# EAGLE design emojipad_v1 (EAGLE 6.4)
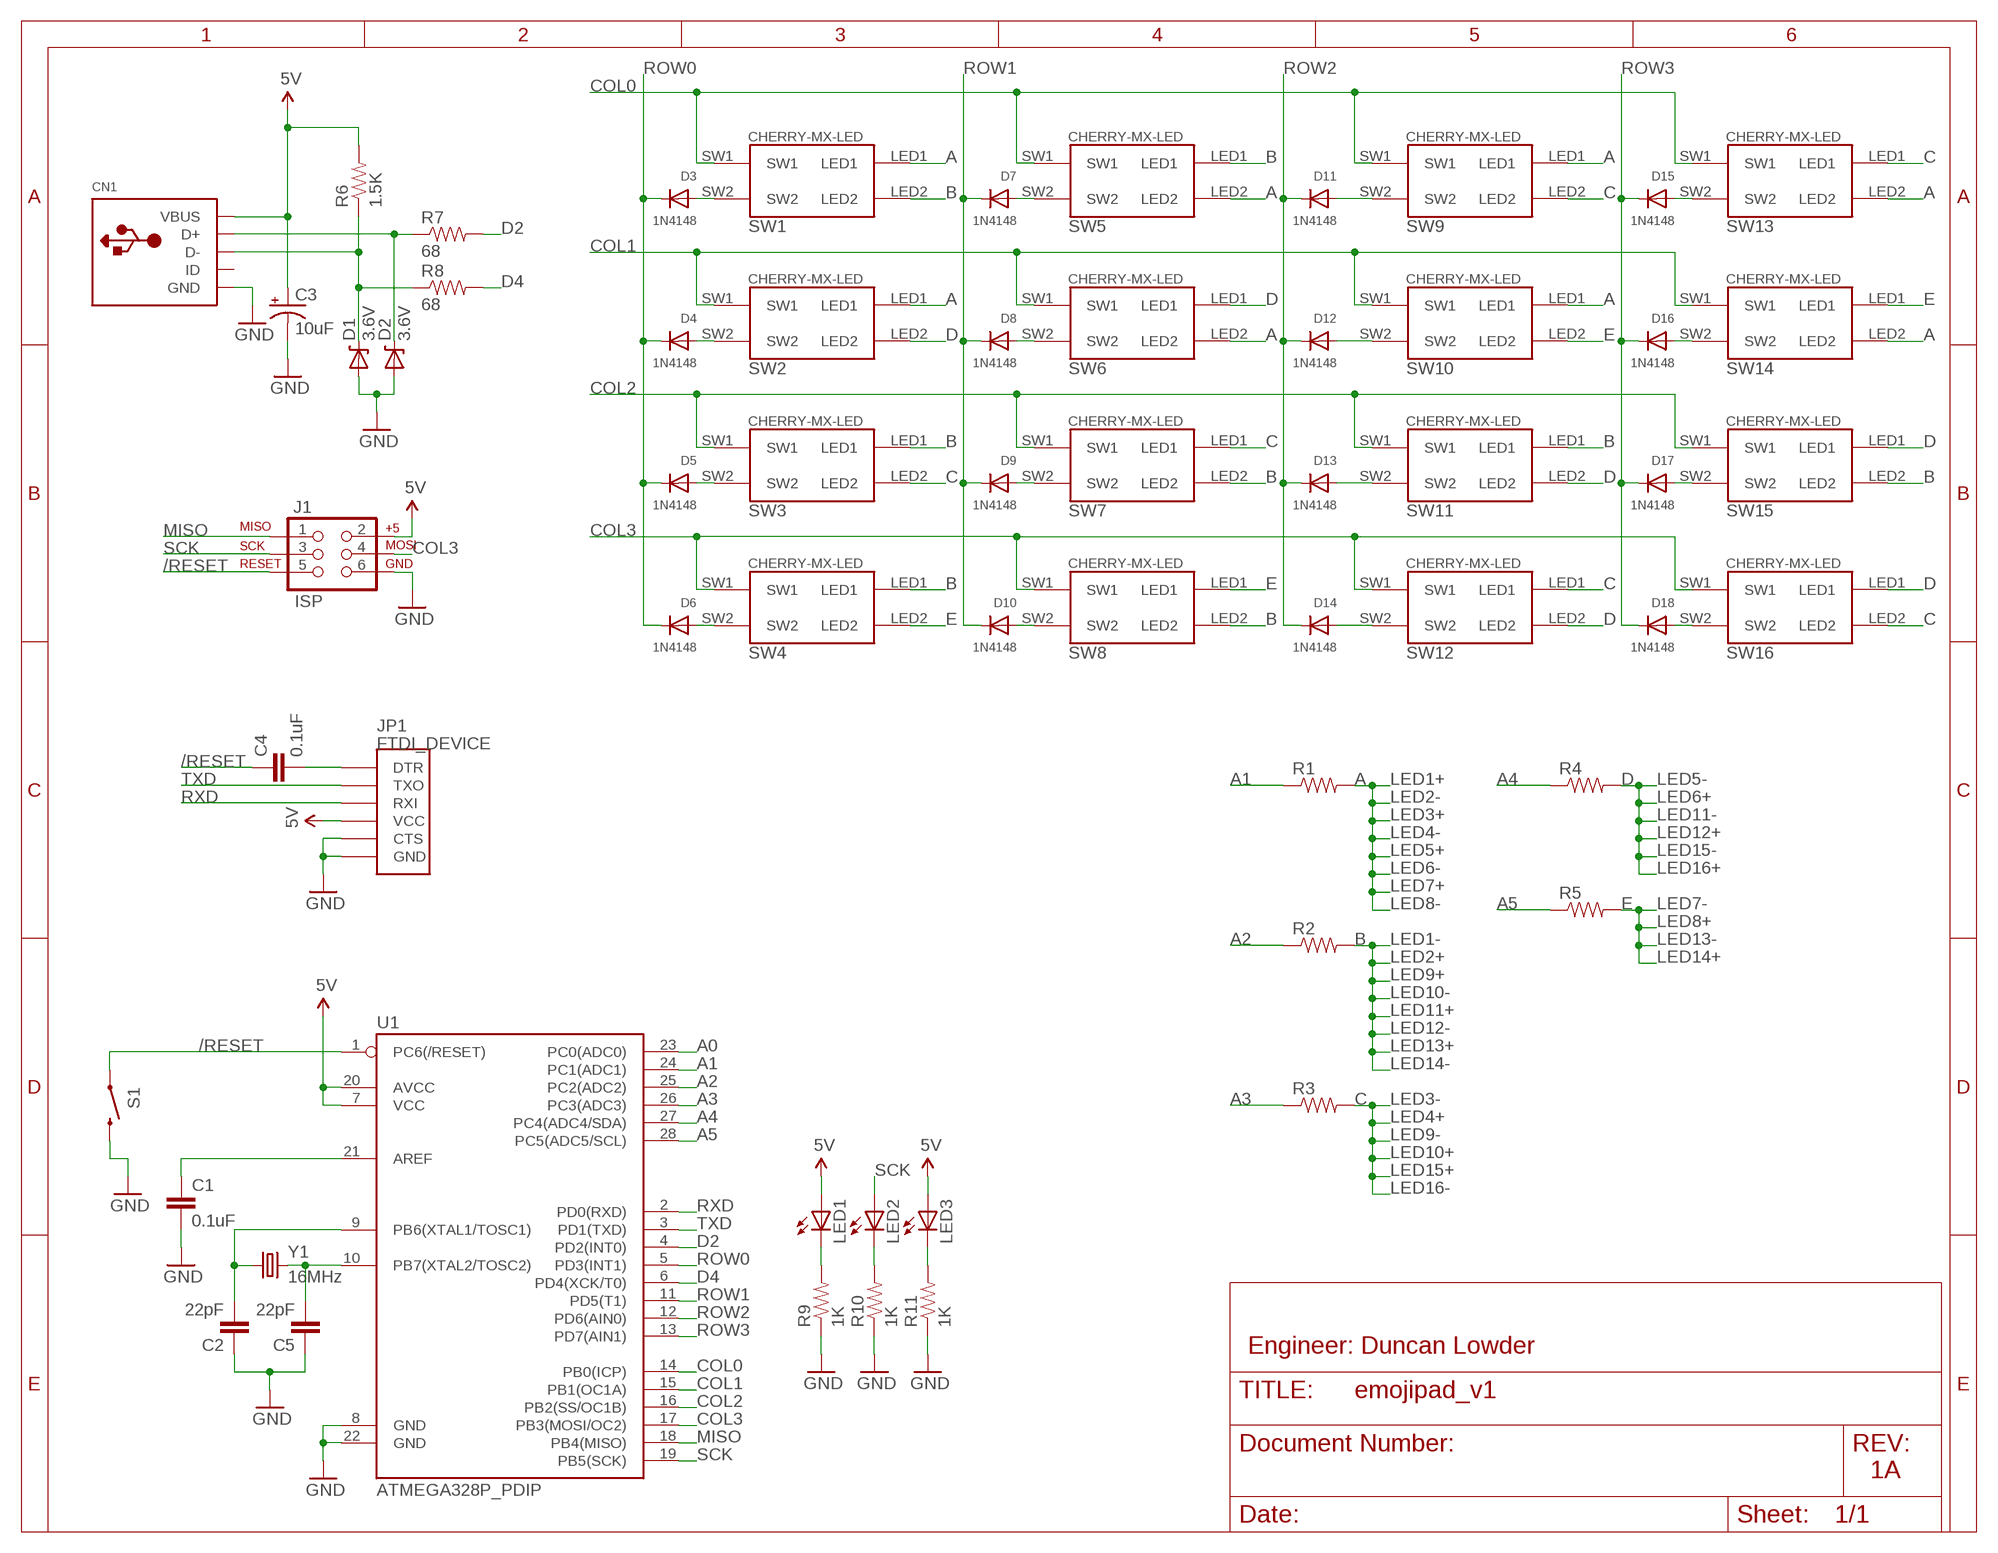
[diagram p0: schematic, sheet 1]

## Parts
C1  0.1uF  CAPPTH  [CAP-PTH-SMALL]
C2  22pF  CAPPTH  [CAP-PTH-SMALL]
C3  10uF  CAP_POLPTH2  [CPOL-RADIAL-10UF-25V]
C4  0.1uF  CAPPTH  [CAP-PTH-SMALL]
C5  22pF  CAPPTH  [CAP-PTH-SMALL]
CN1  USBMOLEX  [USB-MINIB-THM-MOLEX]
D1  3.6V  DIODE-ZENERPTH  [DIODE-ZENER]
D2  3.6V  DIODE-ZENERPTH  [DIODE-ZENER]
D3  1N4148  DIODEDO-1N4148  [DO-1N4148]
D4  1N4148  DIODEDO-1N4148  [DO-1N4148]
D5  1N4148  DIODEDO-1N4148  [DO-1N4148]
D6  1N4148  DIODEDO-1N4148  [DO-1N4148]
D7  1N4148  DIODEDO-1N4148  [DO-1N4148]
D8  1N4148  DIODEDO-1N4148  [DO-1N4148]
D9  1N4148  DIODEDO-1N4148  [DO-1N4148]
D10  1N4148  DIODEDO-1N4148  [DO-1N4148]
D11  1N4148  DIODEDO-1N4148  [DO-1N4148]
D12  1N4148  DIODEDO-1N4148  [DO-1N4148]
D13  1N4148  DIODEDO-1N4148  [DO-1N4148]
D14  1N4148  DIODEDO-1N4148  [DO-1N4148]
D15  1N4148  DIODEDO-1N4148  [DO-1N4148]
D16  1N4148  DIODEDO-1N4148  [DO-1N4148]
D17  1N4148  DIODEDO-1N4148  [DO-1N4148]
D18  1N4148  DIODEDO-1N4148  [DO-1N4148]
J1  ISP  AVR_SPI_PRG_6PTH  [2X3]
JP1  FTDI_DEVICE  [FTDI_DEVICE_SIDE]
LED1  LED3MM  [LED3MM]
LED2  LED3MM  [LED3MM]
LED3  LED3MM  [LED3MM]
R1  RESISTORAXIAL-0.3  [AXIAL-0.3]
R2  RESISTORAXIAL-0.3  [AXIAL-0.3]
R3  RESISTORAXIAL-0.3  [AXIAL-0.3]
R4  RESISTORAXIAL-0.3  [AXIAL-0.3]
R5  RESISTORAXIAL-0.3  [AXIAL-0.3]
R6  1.5K  RESISTORAXIAL-0.3  [AXIAL-0.3]
R7  68  RESISTORAXIAL-0.3  [AXIAL-0.3]
R8  68  RESISTORAXIAL-0.3  [AXIAL-0.3]
R9  1K  RESISTORAXIAL-0.3  [AXIAL-0.3]
R10  1K  RESISTORAXIAL-0.3  [AXIAL-0.3]
R11  1K  RESISTORAXIAL-0.3  [AXIAL-0.3]
S1  SWITCH-MOMENTARY-2SIDE_EZ  [TACTILE-PTH-SIDEEZ]
SW1  CHERRY-MX-LED  [CHERRY-MX-LED]
SW2  CHERRY-MX-LED  [CHERRY-MX-LED]
SW3  CHERRY-MX-LED  [CHERRY-MX-LED]
SW4  CHERRY-MX-LED  [CHERRY-MX-LED]
SW5  CHERRY-MX-LED  [CHERRY-MX-LED]
SW6  CHERRY-MX-LED  [CHERRY-MX-LED]
SW7  CHERRY-MX-LED  [CHERRY-MX-LED]
SW8  CHERRY-MX-LED  [CHERRY-MX-LED]
SW9  CHERRY-MX-LED  [CHERRY-MX-LED]
SW10  CHERRY-MX-LED  [CHERRY-MX-LED]
SW11  CHERRY-MX-LED  [CHERRY-MX-LED]
SW12  CHERRY-MX-LED  [CHERRY-MX-LED]
SW13  CHERRY-MX-LED  [CHERRY-MX-LED]
SW14  CHERRY-MX-LED  [CHERRY-MX-LED]
SW15  CHERRY-MX-LED  [CHERRY-MX-LED]
SW16  CHERRY-MX-LED  [CHERRY-MX-LED]
U1  ATMEGA328P_PDIP  [DIL28-3]
Y1  16MHz  CRYSTALHC49US  [HC49US]

## Nets
5V: C3.1(+) CN1.VBUS J1.2 JP1.P$4(VCC) LED1.A LED3.A R6.P$2 U1.7(VCC) U1.20(AVCC)
/RESET: C4.1 J1.5 S1.1 U1.1(PC6(/RESET))
A: R1.P$2 SW1.LED1 SW2.LED1 SW5.LED2 SW6.LED2 SW9.LED1 SW10.LED1 SW13.LED2 SW14.LED2
A0: U1.23(PC0(ADC0))
A1: R1.P$1 U1.24(PC1(ADC1))
A2: R2.P$1 U1.25(PC2(ADC2))
A3: R3.P$1 U1.26(PC3(ADC3))
A4: R4.P$1 U1.27(PC4(ADC4/SDA))
A5: R5.P$1 U1.28(PC5(ADC5/SCL))
B: R2.P$2 SW1.LED2 SW3.LED1 SW4.LED1 SW5.LED1 SW7.LED2 SW8.LED2 SW11.LED1 SW15.LED2
C: R3.P$2 SW3.LED2 SW7.LED1 SW9.LED2 SW12.LED1 SW13.LED1 SW16.LED2
COL0: SW1.SW1 SW5.SW1 SW9.SW1 SW13.SW1 U1.14(PB0(ICP))
COL1: SW2.SW1 SW6.SW1 SW10.SW1 SW14.SW1 U1.15(PB1(OC1A))
COL2: SW3.SW1 SW7.SW1 SW11.SW1 SW15.SW1 U1.16(PB2(SS/OC1B))
COL3: J1.4 SW4.SW1 SW8.SW1 SW12.SW1 SW16.SW1 U1.17(PB3(MOSI/OC2))
D: R4.P$2 SW2.LED2 SW6.LED1 SW11.LED2 SW12.LED2 SW15.LED1 SW16.LED1
D2: R7.P$2 U1.4(PD2(INT0))
D4: R8.P$2 U1.6(PD4(XCK/T0))
D+: CN1.D+ D2.P$1(C) R7.P$1
D-: CN1.D- D1.P$1(C) R6.P$1 R8.P$1
E: R5.P$2 SW4.LED2 SW8.LED1 SW10.LED2 SW14.LED1
GND: C1.2 C2.1 C3.2(-) C5.1 CN1.GND D1.P$2(A) D2.P$2(A) J1.6 JP1.P$5(CTS) JP1.P$6(GND) R9.P$1 R10.P$1 R11.P$1 S1.2 U1.8(GND) U1.22(GND)
MISO: J1.1 U1.18(PB4(MISO))
N$1: LED1.K(C) R9.P$2
N$2: D3.A SW1.SW2
N$3: D4.A SW2.SW2
N$4: D5.A SW3.SW2
N$5: C1.1 U1.21(AREF)
N$6: C5.2 U1.10(PB7(XTAL2/TOSC2)) Y1.2
N$7: D6.A SW4.SW2
N$8: D7.A SW5.SW2
N$9: D8.A SW6.SW2
N$10: D9.A SW7.SW2
N$11: D10.A SW8.SW2
N$12: D11.A SW9.SW2
N$13: D12.A SW10.SW2
N$14: D13.A SW11.SW2
N$15: D14.A SW12.SW2
N$16: D15.A SW13.SW2
N$17: D16.A SW14.SW2
N$18: D17.A SW15.SW2
N$19: D18.A SW16.SW2
N$20: C2.2 U1.9(PB6(XTAL1/TOSC1)) Y1.1
N$21: LED2.K(C) R10.P$2
N$23: LED3.K(C) R11.P$2
N$26: C4.2 JP1.P$1(DTR)
ROW0: D3.C D4.C D5.C D6.C U1.5(PD3(INT1))
ROW1: D7.C D8.C D9.C D10.C U1.11(PD5(T1))
ROW2: D11.C D12.C D13.C D14.C U1.12(PD6(AIN0))
ROW3: D15.C D16.C D17.C D18.C U1.13(PD7(AIN1))
RXD: JP1.P$3(RXI) U1.2(PD0(RXD))
SCK: J1.3 LED2.A U1.19(PB5(SCK))
TXD: JP1.P$2(TXO) U1.3(PD1(TXD))
Unconnected: CN1.ID

## Notes on the sheet
- LED1+ | LED5-
- LED2- | LED6+
- LED3+ | LED11-
- LED4- | LED12+
- LED5+ | LED15-
- LED6- | LED16+
- LED7+
- LED8- | LED7-
- LED8+
- LED1- | LED13-
- LED2+ | LED14+
- LED9+
- LED10-
- LED11+
- LED12-
- LED13+
- LED14-
- LED3-
- LED4+
- LED9-
- LED10+
- LED15+
- LED16-
- Engineer: Duncan Lowder
- 1A

## Library data of the parts
C1 C2 C5 = SparkFun-Capacitors:CAP: Capacitor Standard 0603 ceramic capacitor, and 0.1" leaded capacitor.
C3 = SparkFun-Capacitors:CAP_POL: Capacitor Polarized These are standard SMD and PTH capacitors. Normally 10uF, 47uF, and 100uF in electrolytic and tantalum varieties. Always verify the external diameter of the through hole cap, it varies with capacity, voltage, and manufacturer. The EIA devices should be standard.
C4 = SparkFun-Passives:CAP: Capacitor Standard 0603 ceramic capacitor, and 0.1" leaded capacitor.
CN1 = adafruit_1:USB: USB Connectors USBMINIB - Surface Mount Female Mini-B USB Connector 4UConnector: 06564 By microbuilder.eu Thru-hole RA Female Mini-B USB Connector 4UConnector: 18732 By ladyada.net
D1 D2 = SparkFun-DiscreteSemi:DIODE-ZENER: Zener Diode Production Part - 8199 3.4V Zener Voltage
D3-D18 = adafruit:DIODE: Diode SMADIODE - SMA Surface Mount Package 20V 1A Schottky Diode Digikey: 641-1014-6-ND DO-1N4148 - Through Hole Small Current Diode SOD-123 20V 1 A (.5mV Vf) Schottky Diode - Digikey: MBRX120TPMSCT-ND SOD-323 10V 570mA (.38mV Vf, 3ns) Schottky Diode - Digikey: ZLLS410CT-ND SOD-523 30V 30mA Schottky Diode (RB751S-40TE61) - Digikey: RB751S-40TE61CT-ND SOT23-R/W - SOT23 Package (R = Solder Paste/Reflow Ovens, W = Hand-Soldering) BAT54Film 40V 300mA - Digikey: 497-7162-1-ND
J1 = SparkFun-Connectors:AVR_SPI_PRG_6: AVR ISP 6 Pin This is the reduced ISP connector for AVR programming. Common on Arduino. This footprint will take up less PCB space and can be used with a 10-pin to 6-pin adapter such as SKU: BOB-08508
JP1 = SparkFun-Connectors:FTDI_DEVICE: Connector which mates to FTDI basic or FTDI cable.
LED1-LED3 = SparkFun-LED:LED: LEDs Standard schematic elements and footprints for 5mm, 3mm, 1206, and 0603 sized LEDs. 5mm - Spark Fun Electronics SKU : COM-00529 (and others)
R1-R6 R9-R11 = SparkFun-Passives:RESISTOR: Resistor Basic schematic elements and footprints for 0603, 1206, and PTH resistors.
R7 R8 = SparkFun-Resistors:RESISTOR: Resistor Basic schematic elements and footprints for 0603, 1206, and PTH resistors.
S1 = SparkFun-Electromechanical:SWITCH-MOMENTARY-2: Various NO switches- pushbuttons, reed, etc
SW1-SW16 = cherrymx:CHERRY-MX-LED: Cherry MX series keyswitch with LED
U1 = SparkFun-DigitalIC:ATMEGA328P_PDIP: uC used in the Arduino 32kb flash, 1k EEPROM, 2k SRAM This is the through-hole version of this chip.
Y1 = SparkFun-FreqCtrl:CRYSTAL: Various standard crystals. Proven footprints. Spark Fun Electronics SKU : COM-00534

## Board
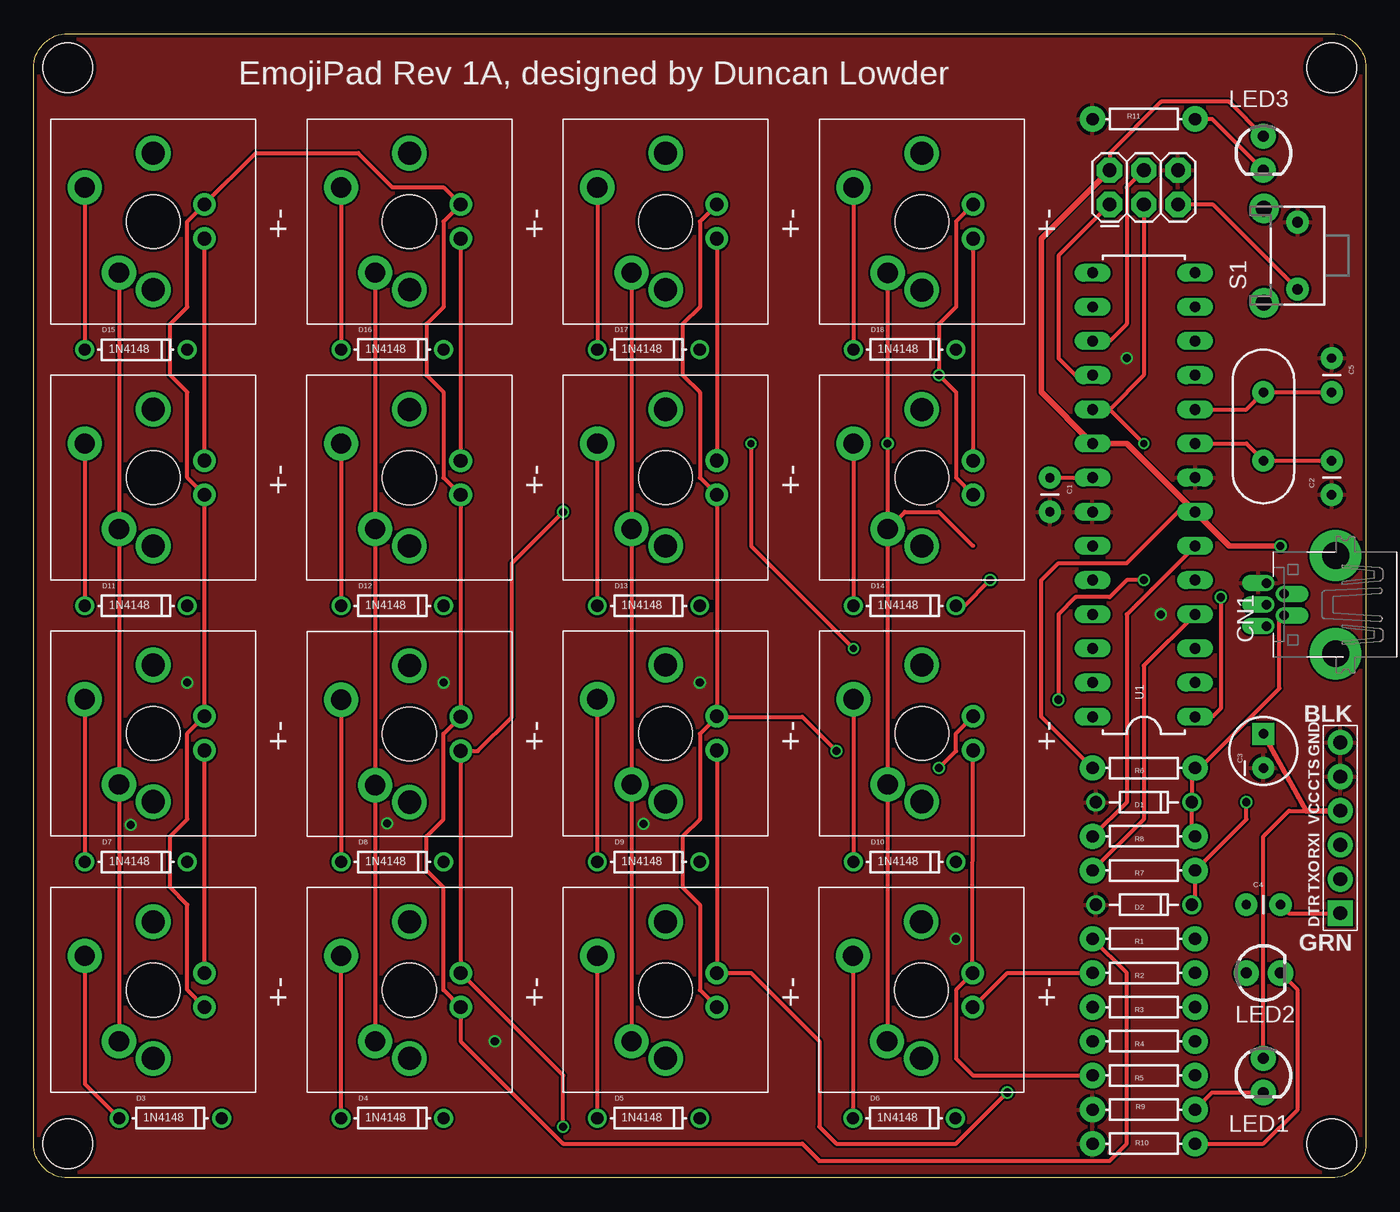
[diagram p1: board, top side]
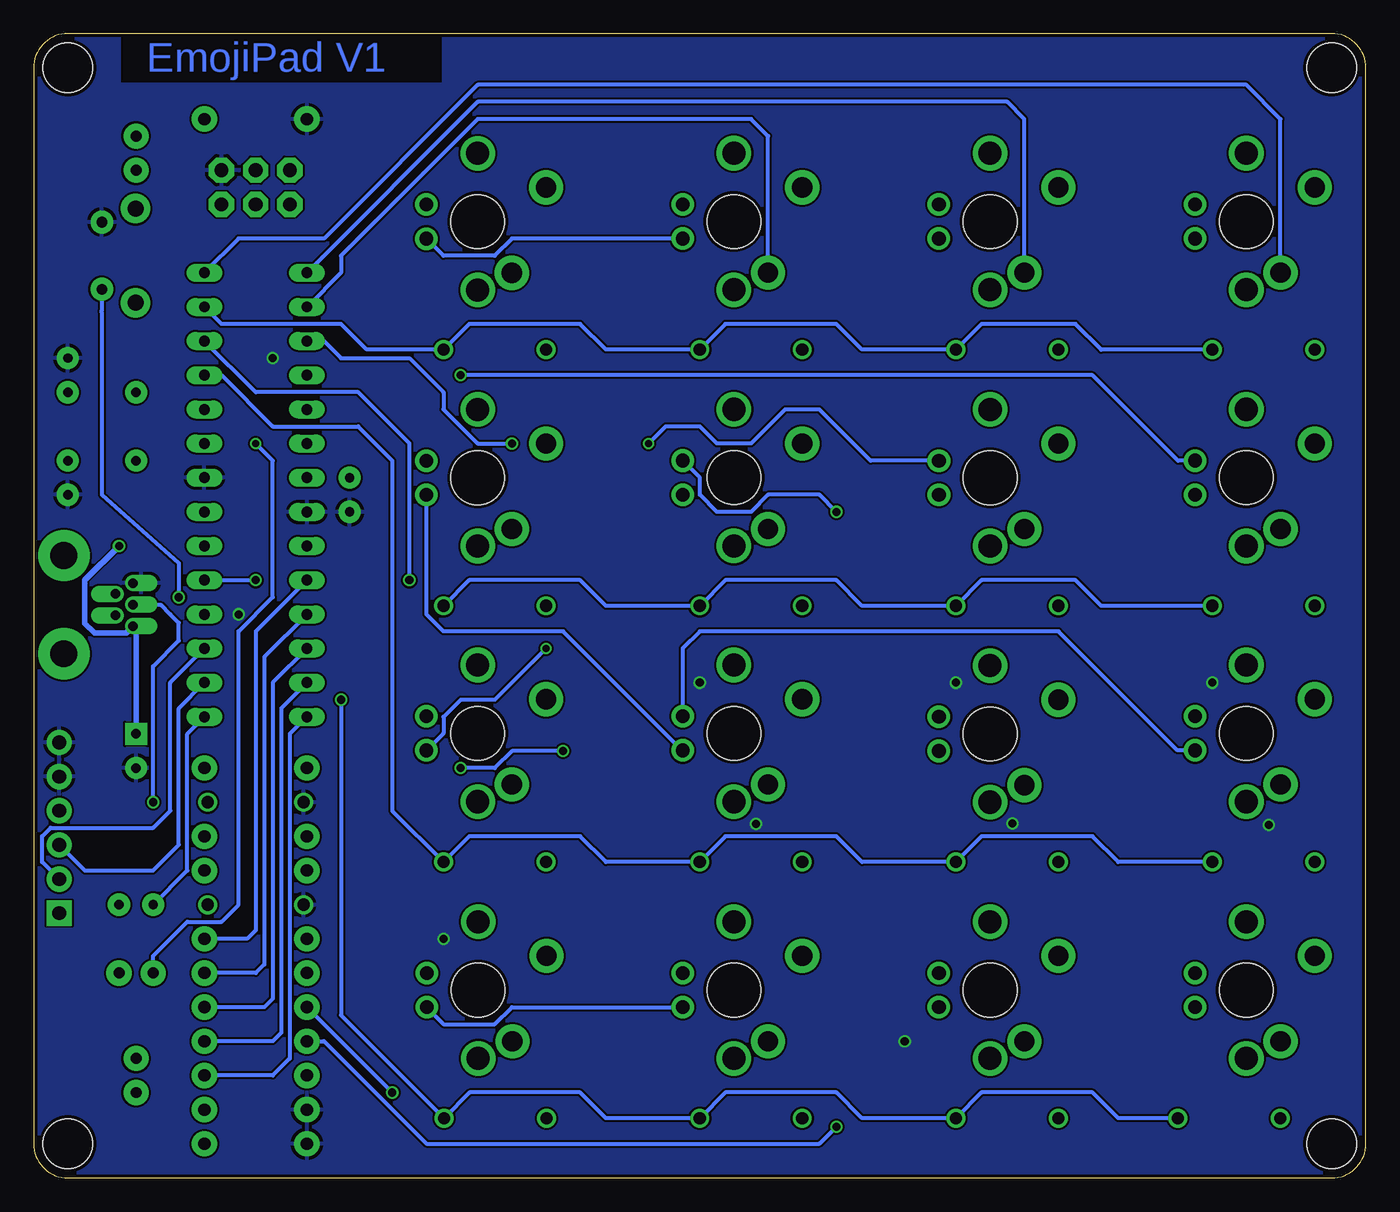
[diagram p2: board, bottom side, seen from below]

Size 99.06 x 85.09 mm. Coordinates in mm from the lower left corner, seen from the top.
Outline: 2.54,85.09 96.52,85.09 arc-90 99.06,82.55 99.06,2.54 arc-90 96.52,0 2.54,0 arc-90 0,2.54 0,82.55 arc-90 2.54,85.09
Copper layers (1*16): Top 0.035mm / dielectric 1.5mm / Bottom 0.035mm
Design rules "SeeedStudio_2layer_DRU_no_angle_20140221": minimum track width 6mil, minimum drill 12mil, track to track 6mil, track to pad 6mil, pad to pad 6mil, via to via 6mil, smd to smd 0mil, copper to edge 10mil, drill to drill 10mil, minimum pad ring 10mil, minimum via ring 6mil, stop-mask expansion 2mil, vias tented up to drill 100mil, thermal gap 10mil
Holes 3.7 mm at 96.52,2.54 2.54,2.54 2.54,82.55 96.52,82.55

### Footprints (pad centres in the part's own frame; a part is rotated, then mirrored left to right if it is on the bottom)
CAP-PTH-SMALL = drill 0.7 pad 1.651: 1 0,0; 2 2.54,0
CPOL-RADIAL-10UF-25V = drill 0.7 pad 1.651 square: 1 1.27,0 | drill 0.7 pad 1.651: 2 -1.27,0
USB-MINIB-THM-MOLEX = drill 0.7 offset: D+ 0,9.72; D- -0.8,8.42; GND 1.6,9.72; ID 0.8,8.42; VBUS -1.6,9.72 | drill 2 pad 3.81: GND1 -3.65,4.57; GND4 3.65,4.57
DIODE-ZENER = drill 0.9: P$1 -3.556,0; P$2 3.556,0
DO-1N4148 = drill 0.9: A -3.81,0; C 3.81,0
2X3 = drill 1.016 pad 1.88 octagon: 1 0,0; 2 0,2.54; 3 2.54,0; 4 2.54,2.54; 5 5.08,0; 6 5.08,2.54
FTDI_DEVICE_SIDE = drill 1.016 pad 1.88 square: P$1 -6.35,0 | drill 1.016 pad 1.88: P$2 -3.81,0; P$3 -1.27,0; P$4 1.27,0; P$5 3.81,0; P$6 6.35,0
LED3MM = drill 0.813 pad 1.88: A -1.27,0; K 1.27,0
AXIAL-0.3 = drill 0.9 pad 1.88: P$1 -3.81,0; P$2 3.81,0
TACTILE-PTH-SIDEEZ = drill 0.8 pad 1.7: 1 -2.5,0; 2 2.5,0 | drill 1.2 pad 2.2: ANCHOR1 -3.5,2.5; ANCHOR2 3.5,2.5
CHERRY-MX-LED = drill 1.016 pad 1.676: LED1 -1.27,-3.81; LED2 1.27,-3.81 | drill 1.714 pad 1.93: P$3 -5.08,0; P$4 5.08,0 | drill 1.5 pad 2.54: SW1 -3.81,2.54; SW2 2.54,5.08 | hole 4: 0,0
DIL28-3 = drill 0.813 long: 1 -16.51,-3.81; 2 -13.97,-3.81; 3 -11.43,-3.81; 4 -8.89,-3.81; 5 -6.35,-3.81; 6 -3.81,-3.81; 7 -1.27,-3.81; 8 1.27,-3.81; 9 3.81,-3.81; 10 6.35,-3.81; 11 8.89,-3.81; 12 11.43,-3.81; 13 13.97,-3.81; 14 16.51,-3.81; 15 16.51,3.81; 16 13.97,3.81; 17 11.43,3.81; 18 8.89,3.81; 19 6.35,3.81; 20 3.81,3.81; 21 1.27,3.81; 22 -1.27,3.81; 23 -3.81,3.81; 24 -6.35,3.81; 25 -8.89,3.81; 26 -11.43,3.81; 27 -13.97,3.81; 28 -16.51,3.81
HC49US = drill 0.7 pad 1.651: 1 -2.54,0; 2 2.54,0

### Placement (x,y rotation side)
C1  75.56,52.07 270 top
C2  96.52,50.8 90 top
C3  91.44,31.75 90 top
C4  90.17,20.32 0 top
C5  96.52,60.96 270 top
CN1  101.38,42.63 90 top
D1  82.55,27.94 180 top
D2  82.55,20.32 180 top
D3  10.16,4.45 0 top
D4  26.67,4.45 0 top
D5  45.72,4.45 0 top
D6  64.73,4.45 0 top
D7  7.62,23.5 0 top
D8  26.67,23.5 0 top
D9  45.72,23.5 0 top
D10  64.77,23.5 0 top
D11  7.62,42.55 0 top
D12  26.67,42.55 0 top
D13  45.72,42.55 0 top
D14  64.77,42.55 0 top
D15  7.6,61.59 0 top
D16  26.67,61.59 0 top
D17  45.72,61.59 0 top
D18  64.77,61.59 0 top
J1  80.01,72.39 0 top
JP1  97.16,26.04 90 top
LED1  91.44,7.62 270 top
LED2  91.44,15.24 0 top
LED3  91.44,76.2 270 top
R1  82.55,17.78 180 top
R2  82.55,15.24 180 top
R3  82.55,12.7 180 top
R4  82.55,10.16 180 top
R5  82.55,7.62 180 top
R6  82.55,30.48 180 top
R7  82.55,22.86 180 top
R8  82.55,25.4 180 top
R9  82.55,5.08 0 top
R10  82.55,2.54 0 top
R11  82.55,78.74 0 top
S1  93.98,68.58 90 top
SW1  8.89,13.97 90 top
SW2  27.94,13.97 90 top
SW3  46.99,13.97 90 top
SW4  66,13.97 90 top
SW5  8.89,33.06 90 top
SW6  27.94,33.02 90 top
SW7  46.99,33.06 90 top
SW8  66.04,33.06 90 top
SW9  8.89,52.07 90 top
SW10  27.94,52.07 90 top
SW11  46.99,52.07 90 top
SW12  66.04,52.07 90 top
SW13  8.89,71.12 90 top
SW14  27.94,71.12 90 top
SW15  46.99,71.12 90 top
SW16  66.04,71.11 90 top
U1  82.55,50.8 90 top
Y1  91.44,55.88 90 top

### Tracks (layer width: path | path; a pad name or v marks a point on that pad's centre or on a via)
5V  (via drill 0.6)
  Top 0.305: R6.P$2 74.93,34.29 74.93,44.45 76.2,45.72 81.28,45.72 85.09,49.53 U1.7 | 96.52,27.3 93.34,27.3 91.44,25.4 LED1.A | LED3.A 88.9,80.01 83.82,80.01 80.01,76.2 J1.2
  Top 0.406: J1.2 74.93,69.85 74.93,58.42 U1.20 81.28,54.61 U1.7 88.9,46.99 v92.71,46.99 | C3.1 94.61,27.3 96.52,27.3 JP1.P$4
  Bottom 0.406: v92.71,46.99 95.25,44.45 95.25,41.23 94.53,40.51 92.18,40.51 CN1.VBUS 91.44,40.8 C3.1
/RESET  (via drill 0.6)
  Top 0.305: v88.27,43.18 88.27,34.92 87.63,34.29 U1.1 | J1.5 87.67,72.39 S1.1
  Bottom 0.305: C4.1 87.63,22.86 87.63,33.02 U1.1 | v88.27,43.18 88.27,45.72 93.98,50.8 93.98,64.34 93.99,64.53 93.98,64.77 S1.1
A
  Top 0.305: SW9.LED1 SW5.LED2 11.43,33.06 11.43,26.67 10.16,25.4 10.16,21.59 11.43,20.32 11.43,13.97 SW1.LED1 | SW13.LED2 | SW13.LED2 16.51,76.2 24.13,76.2 26.67,73.66 30.48,73.66 SW14.LED2 30.48,71.12 30.48,64.77 29.21,63.5 29.21,59.69 30.48,58.42 30.48,52.06 SW10.LED1 SW6.LED2 30.48,33.02 30.48,26.67 29.21,25.4 29.21,22.86 30.48,21.59 30.48,13.97 SW2.LED1 31.75,10.16 39.37,2.54 57.15,2.54 58.42,1.27 80.01,1.27 81.28,2.54 81.28,15.24 R1.P$2 | SW9.LED1 | SW9.LED1 11.43,52.07 11.43,58.42 10.16,59.69 10.16,63.5 11.43,64.77 11.43,71.12 SW13.LED2
A1
  Bottom 0.305: U1.24 82.55,40.64 82.55,18.41 83.19,17.78 R1.P$1
A2
  Bottom 0.305: U1.25 81.92,38.73 81.92,15.88 82.55,15.24 R2.P$1
A3
  Bottom 0.305: U1.26 81.28,36.83 81.28,13.34 81.92,12.7 R3.P$1
A4
  Bottom 0.305: U1.27 80.64,34.92 80.64,10.79 81.28,10.16 R4.P$1
A5
  Bottom 0.305: U1.28 80.01,33.02 80.01,8.89 81.28,7.62 R5.P$1
B  (via drill 0.6)
  Top 0.305: SW5.LED1 SW1.LED2 | SW15.LED2 49.53,71.12 49.53,64.77 48.26,63.5 48.26,59.69 49.53,58.42 49.53,52.07 SW11.LED1 SW7.LED2 50.8,34.29 | 50.8,34.29 49.53,33.02 49.53,26.67 48.26,25.4 48.26,21.59 49.53,20.32 49.53,13.97 SW3.LED1 | 50.8,34.29 57.15,34.29 v59.69,31.75 | v67.31,30.48 68.58,31.75 68.58,33.06 SW8.LED2 | SW4.LED1 69.85,12.7 72.39,15.24 R2.P$2
  Bottom 0.305: SW5.LED1 14.01,31.79 22.86,40.64 49.53,40.64 50.8,39.37 SW7.LED2 | v59.69,31.75 63.5,31.75 64.77,30.48 v67.31,30.48 | SW4.LED1 69.81,12.66 68.58,11.43 64.77,11.43 63.5,12.7 SW3.LED1
C  (via drill 0.6)
  Top 0.305: SW13.LED1 SW9.LED2 | SW7.LED1 SW3.LED2 53.34,15.24 58.42,10.16 58.42,3.81 59.69,2.54 68.58,2.54 v72.39,6.35 | SW16.LED2 68.58,71.12 68.58,64.77 67.31,63.5 v67.31,59.69 68.58,58.42 68.58,52.07 SW12.LED1
  Bottom 0.305: SW9.LED2 13.97,53.34 20.32,59.69 v67.31,59.69 | SW7.LED1 50.84,31.79 59.69,40.64 68.58,40.64 69.85,41.91 SW12.LED1 | v72.39,6.35 R3.P$2
COL0
  Top 0.305: SW13.SW1 SW9.SW1 SW5.SW1 SW1.SW1
  Bottom 0.305: SW13.SW1 6.35,78.74 8.89,81.28 66.04,81.28 77.47,69.85 83.82,69.85 U1.14
COL1
  Top 0.305: SW10.SW1 SW6.SW1 SW2.SW1 | SW14.SW1 SW10.SW1 | SW10.SW1
  Bottom 0.305: SW14.SW1 25.4,78.74 26.67,80.01 66.04,80.01 U1.15
COL2
  Top 0.305: SW15.SW1 SW11.SW1 SW7.SW1 44.45,29.21 SW3.SW1
  Bottom 0.305: SW15.SW1 44.45,77.47 45.72,78.74 66.04,78.74 76.2,68.58 76.2,67.31 U1.16
COL3  (via drill 0.6)
  Top 0.305: J1.4 81.28,73.66 81.28,63.5 80.01,62.23 U1.17 | SW16.SW1 v63.5,54.61 SW12.SW1 | SW12.SW1 SW8.SW1 63.5,10.16 SW4.SW1 | SW12.SW1 64.77,49.53 67.31,49.53 69.85,46.99
  Bottom 0.305: U1.17 77.47,62.23 76.2,60.96 71.12,60.96 68.58,58.42 68.58,57.15 66.04,54.61 v63.5,54.61
D  (via drill 0.6)
  Top 0.305: SW15.LED1 SW11.LED2 | SW16.LED1 SW12.LED2 | v39.37,49.53 35.56,45.72 35.56,34.29 33.02,31.75 SW6.LED1 SW2.LED2 39.37,7.62 v39.37,3.81
  Bottom 0.305: SW15.LED1 63.5,69.85 64.77,68.58 68.59,68.58 SW16.LED1 | v39.37,49.53 40.64,50.8 44.45,50.8 45.72,49.53 48.26,49.53 49.53,50.8 49.53,52.07 SW11.LED2 | R4.P$2 77.47,10.16 69.85,2.54 40.64,2.54 v39.37,3.81
D2
  Top 0.305: U1.4 82.55,38.1 82.55,26.67 R7.P$2
D4
  Top 0.305: U1.6 81.28,41.91 81.28,27.94 R8.P$2
D+  (via drill 0.6)
  Top 0.305: D2.P$1 86.36,20.57 R7.P$1 90.17,26.67 v90.17,27.94
  Bottom 0.305: v90.17,27.94 90.17,38.05 88.27,39.95 88.27,41.27 88.9,41.91 88.91,41.91 89.59,42.59 91.63,42.59 CN1.D+
D-
  Top 0.305: R8.P$1 86.11,25.65 D1.P$1 86.11,30.23 R6.P$1 86.72,30.48 92.63,36.4 92.63,41.5 CN1.D-
E  (via drill 0.5)
  Top 0.305: SW8.LED1 SW4.LED2 69.81,15.2 68.58,13.97 68.58,8.89 69.85,7.62 R5.P$2 | SW14.LED1 SW10.LED2 | v53.34,54.61 53.34,46.99 v60.96,39.37
  Bottom 0.305: SW10.LED2 36.83,53.34 40.64,57.15 43.18,57.15 45.72,54.61 48.26,54.61 49.53,55.88 52.07,55.88 v53.34,54.61 | v60.96,39.37 64.77,35.56 67.31,35.56 68.58,34.29 68.58,33.06 SW8.LED1
GND  (via drill 0.6)
  Bottom 0.152: 97.21,30.48 97.79,30.48 JP1.P$5
  other vias: 68.58,17.78 81.28,60.96 83.82,41.91 11.43,36.83 30.48,36.83 49.53,36.83 45.34,26.33 26.28,26.37 7.22,26.24 34.29,10.16
  pour Top: 0,0 0,85.09 99.06,85.09 99.06,0
  pour Bottom: 0,0 0,85.09 68.58,85.09 68.58,81.28 92.71,81.28 92.71,85.09 99.06,85.09 99.06,0
MISO
  Top 0.305: J1.1 76.2,68.58 76.2,60.96 77.47,59.69 U1.18
N$1
  Top 0.305: R9.P$2 87.63,6.35 LED1.K
N$2
  Top 0.305: SW1.SW2 3.81,6.99 D3.A
N$3
  Top 0.305: D4.A SW2.SW2
N$4
  Top 0.305: SW3.SW2 D5.A
N$5
  Top 0.305: C1.1 U1.21
N$6
  Top 0.305: U1.10 90.17,57.15 Y1.2 C5.2
N$7
  Top 0.305: SW4.SW2 D6.A
N$8
  Top 0.305: SW5.SW2 D7.A
N$9
  Top 0.305: SW6.SW2 D8.A
N$10
  Top 0.305: SW7.SW2 D9.A
N$11
  Top 0.305: SW8.SW2 D10.A
N$12
  Top 0.305: SW9.SW2 D11.A
N$13
  Top 0.305: SW10.SW2 D12.A
N$14
  Top 0.305: SW11.SW2 D13.A
N$15
  Top 0.305: SW12.SW2 D14.A
N$16
  Top 0.305: SW13.SW2 3.81,61.61 D15.A
N$17
  Top 0.305: SW14.SW2 D16.A
N$18
  Top 0.305: SW15.SW2 D17.A
N$19
  Top 0.305: SW16.SW2 D18.A
N$20
  Top 0.305: U1.9 90.17,54.61 Y1.1 C2.2
N$21
  Top 0.305: R10.P$2 91.44,2.54 93.98,5.08 93.98,13.97 LED2.K
N$23
  Top 0.305: LED3.K 87.63,78.74 R11.P$2
N$26
  Top 0.305: C4.2 93.34,19.68 JP1.P$1
ROW0  (via drill 0.6)
  Top 0.305: v82.55,44.45 81.28,44.45 80.01,43.18 77.47,43.18 76.2,41.91 v76.2,35.56
  Bottom 0.305: D3.C 18.41,4.45 20.32,6.35 28.57,6.35 D4.C 37.47,4.45 39.37,6.35 47.62,6.35 D5.C 56.52,4.45 58.42,6.35 66.63,6.35 D6.C 76.2,12.11 v76.2,35.56 | U1.5 v82.55,44.45
ROW1
  Bottom 0.305: D7.C 18.41,23.5 20.32,25.4 28.57,25.4 D8.C 37.47,23.5 39.37,25.4 47.62,25.4 D9.C 56.52,23.5 58.42,25.4 66.67,25.4 D10.C 72.39,27.3 72.39,53.34 74.93,55.88 81.28,55.88 85.09,59.69 U1.11
ROW2  (via drill 0.6)
  Top 0.305: D14.C 69.22,42.55 v71.12,44.45
  Bottom 0.305: D11.C 19.68,42.55 21.59,44.45 28.57,44.45 D12.C 37.47,42.55 39.37,44.45 47.62,44.45 D13.C 56.52,42.55 58.42,44.45 66.67,44.45 D14.C | v71.12,44.45 71.12,54.61 74.93,58.42 82.55,58.42 U1.12
ROW3
  Bottom 0.305: D15.C 19.68,61.59 21.59,63.5 28.57,63.5 D16.C 37.47,61.59 39.37,63.5 47.62,63.5 D17.C 56.52,61.59 58.42,63.5 66.67,63.5 D18.C 74.3,61.59 76.2,63.5 85.09,63.5 U1.13
RXD
  Bottom 0.305: JP1.P$3 95.25,22.86 90.17,22.86 88.27,24.77 88.27,34.92 U1.2
SCK  (via drill 0.5)
  Top 0.305: J1.3 82.55,59.69 80.01,57.15 | 80.01,57.15 U1.19 | v82.55,54.61 80.01,57.15
  Bottom 0.305: LED2.A 90.17,16.51 87.63,19.05 85.09,19.05 83.82,20.32 83.82,40.64 81.28,43.18 81.28,53.34 v82.55,54.61
TXD
  Bottom 0.305: JP1.P$2 98.42,23.5 98.42,25.4 97.79,26.04 90.17,26.04 88.9,27.3 88.9,36.83 U1.3

### Text on the board
Bottom: EmojiPad V1
tNames: EmojiPad Rev 1A, designed by Duncan Lowder | +- | +- | +- | +- | +- | +- | +- | +- | +- | +- | +- | +- | +- | +- | +-